# Altium schematic sheet Sheet2.SchDoc
size A4
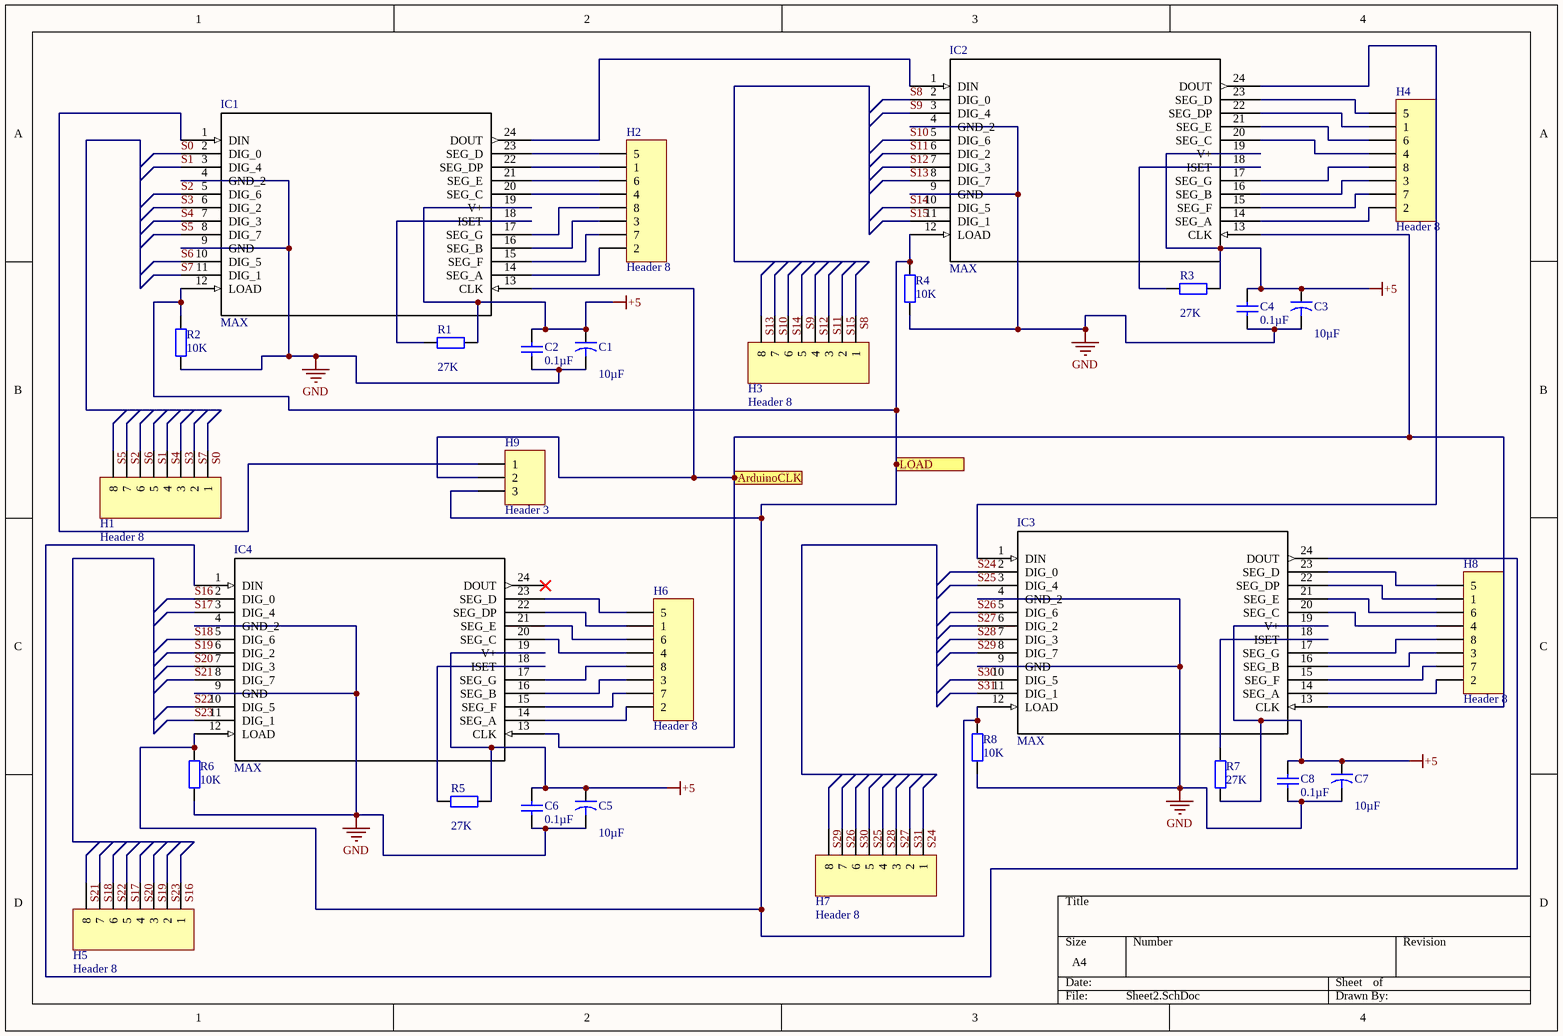
[diagram p0: Sheet2.SchDoc]

## Parts
C1  value 10µF  [CAPR5-4X5]  (hidden comment: Cap2)
C2  0.1µF  [CAPC2013X94X50ML20T25]
C3  value 10µF  [CAPR5-4X5]  (hidden comment: Cap2)
C4  0.1µF  [CAPC2013X94X50ML20T25]
C5  value 10µF  [CAPR5-4X5]  (hidden comment: Cap2)
C6  0.1µF  [CAPC2013X94X50ML20T25]
C7  value 10µF  [CAPR5-4X5]  (hidden comment: Cap2)
C8  0.1µF  [CAPC2013X94X50ML20T25]
H1  Header 8  [HDR1X8]
H2  Header 8  [HDR1X8]
H3  Header 8  [HDR1X8]
H4  Header 8  [HDR1X8]
H5  Header 8  [HDR1X8]
H6  Header 8  [HDR1X8]
H7  Header 8  [HDR1X8]
H8  Header 8  [HDR1X8]
H9  Header 3  [HDR1X3]
IC1  MAX  [*21-0042B_24]
IC2  MAX  [*21-0042B_24]
IC3  MAX  [*21-0042B_24]
IC4  MAX  [*21-0042B_24]
R1  value 27K  [AXIAL-0.4]  (hidden comment: Res2)
R2  value 10K  [AXIAL-0.4]  (hidden comment: Res2)
R3  value 27K  [AXIAL-0.4]  (hidden comment: Res2)
R4  value 10K  [AXIAL-0.4]  (hidden comment: Res2)
R5  value 27K  [AXIAL-0.4]  (hidden comment: Res2)
R6  value 10K  [AXIAL-0.4]  (hidden comment: Res2)
R7  value 27K  [AXIAL-0.4]  (hidden comment: Res2)
R8  value 10K  [AXIAL-0.4]  (hidden comment: Res2)

## Ports
ArduinoCLK, LOAD

## Nets
+5: C1.1 C2.1 C3.1 C4.2 C5.1 C6.2 C7.1 C8.2 IC1.19(V+) IC2.19(V+) IC3.19(V+) IC4.19(V+) R1.2 R3.2 R5.2 R7.1
GND: C1.2 C2.2 C3.2 C4.1 C5.2 C6.1 C7.2 C8.1 IC1.4(GND_2) IC1.9(GND) IC2.4(GND_2) IC2.9(GND) IC3.4(GND_2) IC3.9(GND) IC4.4(GND_2) IC4.9(GND) R2.1 R4.1 R6.1 R8.1
ArduinoCLK: H9.2 IC1.13(CLK) IC2.13(CLK) IC3.13(CLK) IC4.13(CLK) ; port ArduinoCLK
LOAD: H9.3 IC1.12(LOAD) IC2.12(LOAD) IC3.12(LOAD) IC4.12(LOAD) R2.2 R4.2 R6.2 R8.2 ; port LOAD
S0: H1.1 IC1.2(DIG_0)
S1: H1.5 IC1.3(DIG_4)
S2: H1.7 IC1.5(DIG_6)
S3: H1.3 IC1.6(DIG_2)
S4: H1.4 IC1.7(DIG_3)
S5: H1.8 IC1.8(DIG_7)
S6: H1.6 IC1.10(DIG_5)
S7: H1.2 IC1.11(DIG_1)
S8: H3.1 IC2.2(DIG_0)
S9: H3.5 IC2.3(DIG_4)
S10: H3.7 IC2.5(DIG_6)
S11: H3.3 IC2.6(DIG_2)
S12: H3.4 IC2.7(DIG_3)
S13: H3.8 IC2.8(DIG_7)
S14: H3.6 IC2.10(DIG_5)
S15: H3.2 IC2.11(DIG_1)
S16: H5.1 IC4.2(DIG_0)
S17: H5.5 IC4.3(DIG_4)
S18: H5.7 IC4.5(DIG_6)
S19: H5.3 IC4.6(DIG_2)
S20: H5.4 IC4.7(DIG_3)
S21: H5.8 IC4.8(DIG_7)
S22: H5.6 IC4.10(DIG_5)
S23: H5.2 IC4.11(DIG_1)
S24: H7.1 IC3.2(DIG_0)
S25: H7.5 IC3.3(DIG_4)
S26: H7.7 IC3.5(DIG_6)
S27: H7.3 IC3.6(DIG_2)
S28: H7.4 IC3.7(DIG_3)
S29: H7.8 IC3.8(DIG_7)
S30: H7.6 IC3.10(DIG_5)
S31: H7.2 IC3.11(DIG_1)
NetH2_1: H2.1(5) IC1.23(SEG_D)
NetH2_2: H2.2(1) IC1.22(SEG_DP)
NetH2_3: H2.3(6) IC1.21(SEG_E)
NetH2_4: H2.4 IC1.20(SEG_C)
NetH2_5: H2.5(8) IC1.17(SEG_G)
NetH2_6: H2.6(3) IC1.16(SEG_B)
NetH2_7: H2.7 IC1.15(SEG_F)
NetH2_8: H2.8(2) IC1.14(SEG_A)
NetH4_1: H4.1(5) IC2.23(SEG_D)
NetH4_2: H4.2(1) IC2.22(SEG_DP)
NetH4_3: H4.3(6) IC2.21(SEG_E)
NetH4_4: H4.4 IC2.20(SEG_C)
NetH4_5: H4.5(8) IC2.17(SEG_G)
NetH4_6: H4.6(3) IC2.16(SEG_B)
NetH4_7: H4.7 IC2.15(SEG_F)
NetH4_8: H4.8(2) IC2.14(SEG_A)
NetH6_1: H6.1(5) IC4.23(SEG_D)
NetH6_2: H6.2(1) IC4.22(SEG_DP)
NetH6_3: H6.3(6) IC4.21(SEG_E)
NetH6_4: H6.4 IC4.20(SEG_C)
NetH6_5: H6.5(8) IC4.17(SEG_G)
NetH6_6: H6.6(3) IC4.16(SEG_B)
NetH6_7: H6.7 IC4.15(SEG_F)
NetH6_8: H6.8(2) IC4.14(SEG_A)
NetH8_1: H8.1(5) IC3.23(SEG_D)
NetH8_2: H8.2(1) IC3.22(SEG_DP)
NetH8_3: H8.3(6) IC3.21(SEG_E)
NetH8_4: H8.4 IC3.20(SEG_C)
NetH8_5: H8.5(8) IC3.17(SEG_G)
NetH8_6: H8.6(3) IC3.16(SEG_B)
NetH8_7: H8.7 IC3.15(SEG_F)
NetH8_8: H8.8(2) IC3.14(SEG_A)
NetH9_1: H9.1 IC1.1(DIN)
NetIC1_18: IC1.18(ISET) R1.1
NetIC1_24: IC1.24(DOUT) IC2.1(DIN)
NetIC2_18: IC2.18(ISET) R3.1
NetIC2_24: IC2.24(DOUT) IC3.1(DIN)
NetIC3_18: IC3.18(ISET) R7.2
NetIC3_24: IC3.24(DOUT) IC4.1(DIN)
NetIC4_18: IC4.18(ISET) R5.1

Not connected (* = marked no-connect by the designer): IC4 24(DOUT)*

## Library data of the parts
C1 C3 C5 C7 = Cap2: Capacitor; Published: 23-Sep-2002; PackageReference: CAPR5-4X5; Publisher: Altium Limited; PackageDescription: Capacitor; 2 Leads
C2 C4 C6 C8 = CMP-2000-05016-1: Chip Capacitor, Ceramic, 0.1 uF, 10%, 50 V, 0805, RoHS, Tape and Reel; Manufacturer: AVX; Rated Voltage: 50V; Capacitance: 100nF; Dielectric: X7R; Case Size/Dimension: 0805; Tolerance (%): ±10%; Datasheet URL: http://www.farnell.com/datasheets/319609.pdf; Datasheet Version: Sep-07; Manufacturer URL: http://www.avx.com/
H1-H8 = Header 8: Header, 8-Pin; LatestRevisionDate: 17-Jul-2002; LatestRevisionNote: Re-released for DXP Platform.; Publisher: Altium Limited
H9 = Header 3: Header, 3-Pin; LatestRevisionDate: 17-Jul-2002; LatestRevisionNote: Re-released for DXP Platform.; Publisher: Altium Limited
R1-R8 = Res2: Resistor; Published: 8-Jun-2000; LatestRevisionDate: 17-Jul-2002; LatestRevisionNote: Re-released for DXP Platform.; PackageReference: AXIAL-0.4; Publisher: Altium Limited; PackageDescription: Axial Device, Thru-Hole; 2 Leads; 0.4 in Pin Spacing